# Altium schematic sheet SwitchingModule.SchDoc
size A4
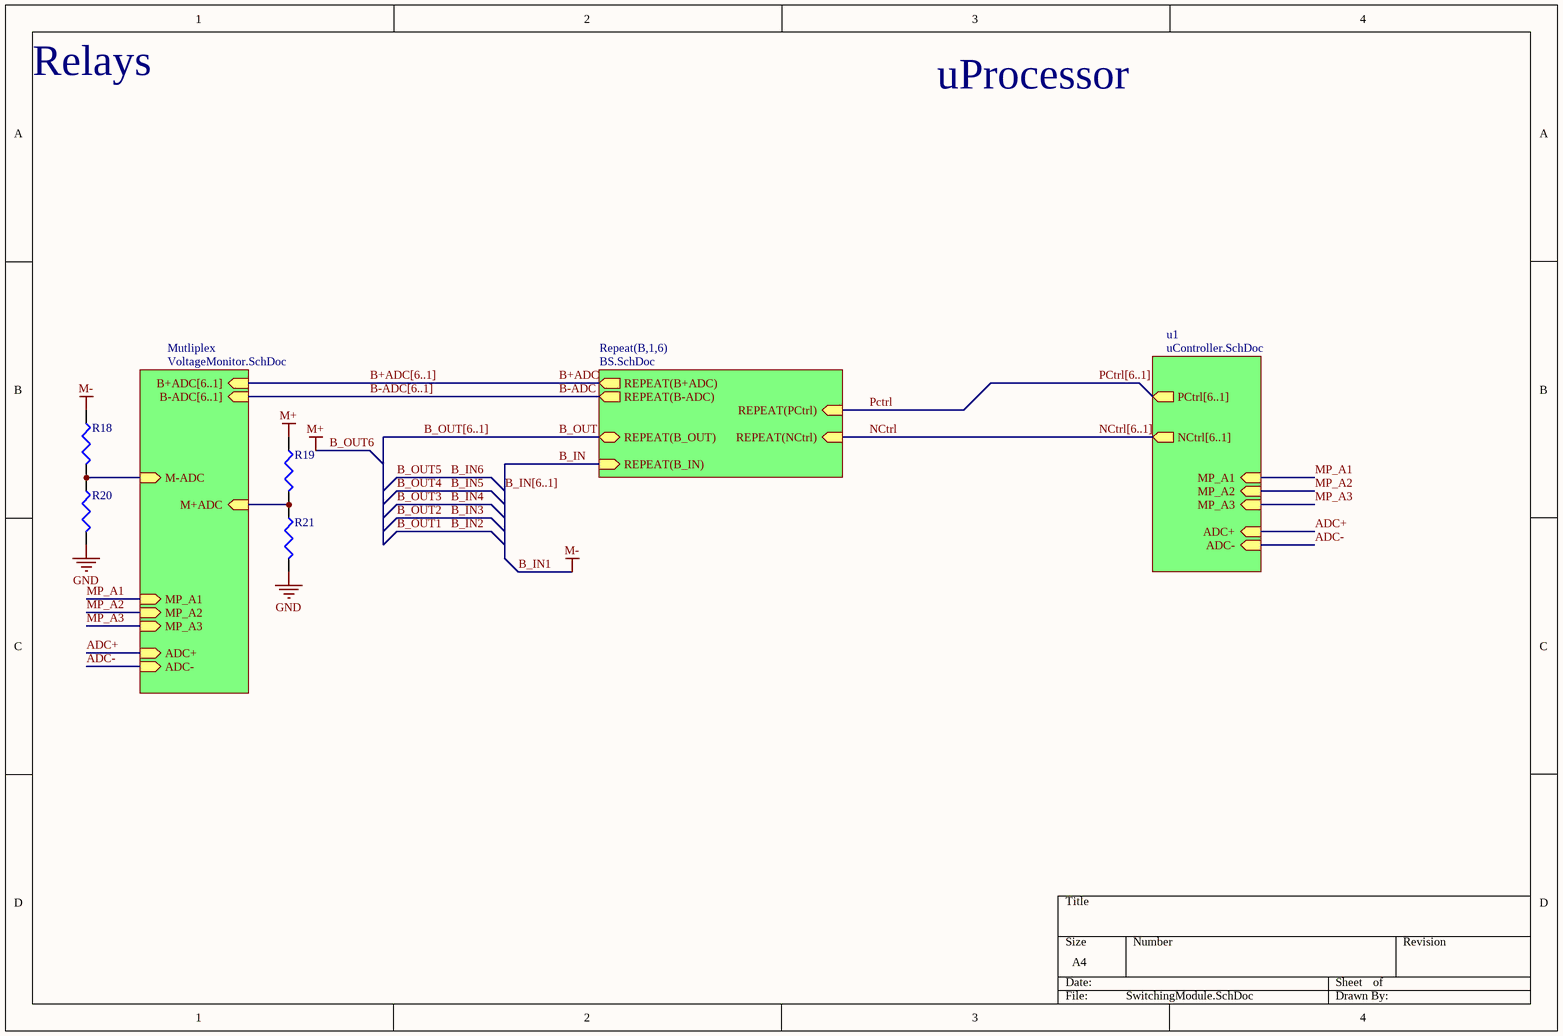
[diagram p0: SwitchingModule.SchDoc]

## Parts
R18  Res3  [J1-0603]  (value not drawn)
R19  Res3  [J1-0603]  (value not drawn)
R20  Res3  [J1-0603]  (value not drawn)
R21  Res3  [J1-0603]  (value not drawn)

## Sub-sheets
Mutliplex = VoltageMonitor.SchDoc: MP_A1 (in), MP_A2 (in), MP_A3 (in), ADC+ (in), ADC- (in), B+ADC[6..1] (in), B-ADC[6..1] (in), M+ADC (in), M-ADC (in)
Repeat(B,1,6) = BS.SchDoc: REPEAT(PCtrl) (in), REPEAT(NCtrl) (in), REPEAT(B+ADC) (out), REPEAT(B_IN) (in), REPEAT(B_OUT) (bidir), REPEAT(B-ADC) (out)
u1 = uController.SchDoc: PCtrl[6..1] (out), NCtrl[6..1] (out), MP_A1 (in), MP_A2 (in), MP_A3 (in), ADC+ (in), ADC- (in)

## Nets
B_IN1: R18.1  [also labelled M-]
B_OUT6: R19.1  [also labelled M+]
GND: R20.1 R21.1
ADC+: sheet Mutliplex/ADC+, sheet u1/ADC+
ADC-: sheet Mutliplex/ADC-, sheet u1/ADC-
B+ADC: sheet Repeat(B,1,6)/REPEAT(B+ADC)
B-ADC: sheet Repeat(B,1,6)/REPEAT(B-ADC)
B_IN: sheet Repeat(B,1,6)/REPEAT(B_IN)
B_OUT: sheet Repeat(B,1,6)/REPEAT(B_OUT)
MP_A1: sheet Mutliplex/MP_A1, sheet u1/MP_A1
MP_A2: sheet Mutliplex/MP_A2, sheet u1/MP_A2
MP_A3: sheet Mutliplex/MP_A3, sheet u1/MP_A3
NCtrl: sheet Repeat(B,1,6)/REPEAT(NCtrl)
Pctrl: sheet Repeat(B,1,6)/REPEAT(PCtrl)
NetR18_2: R18.2 R20.2 ; sheet Mutliplex/M-ADC
NetR19_2: R19.2 R21.2 ; sheet Mutliplex/M+ADC

## Buses and harness runs
bus B+ADC[6..1] = sheet Mutliplex/B+ADC[6..1]
bus B-ADC[6..1] = sheet Mutliplex/B-ADC[6..1]
bus B_IN[6..1]
bus B_OUT[6..1]
bus NCtrl[6..1] = sheet u1/NCtrl[6..1]
bus PCtrl[6..1] = sheet u1/PCtrl[6..1]

## Notes on the sheet
- Relays
- uProcessor

## Library data of the parts
R18 R19 = Res3: Resistor; Value: 100K; Published: 8-Jun-2000; LatestRevisionDate: 29-May-2009; LatestRevisionNote: IPC-7351 Footprint Added.; PackageReference: J1-0603; Publisher: Altium Limited; PackageDescription: Chip Resistor
R20 R21 = Res3: Resistor; Value: 1K; Published: 8-Jun-2000; LatestRevisionDate: 29-May-2009; LatestRevisionNote: IPC-7351 Footprint Added.; PackageReference: J1-0603; Publisher: Altium Limited; PackageDescription: Chip Resistor